# EAGLE schematic basic_sachematic (EAGLE 9.4.2)
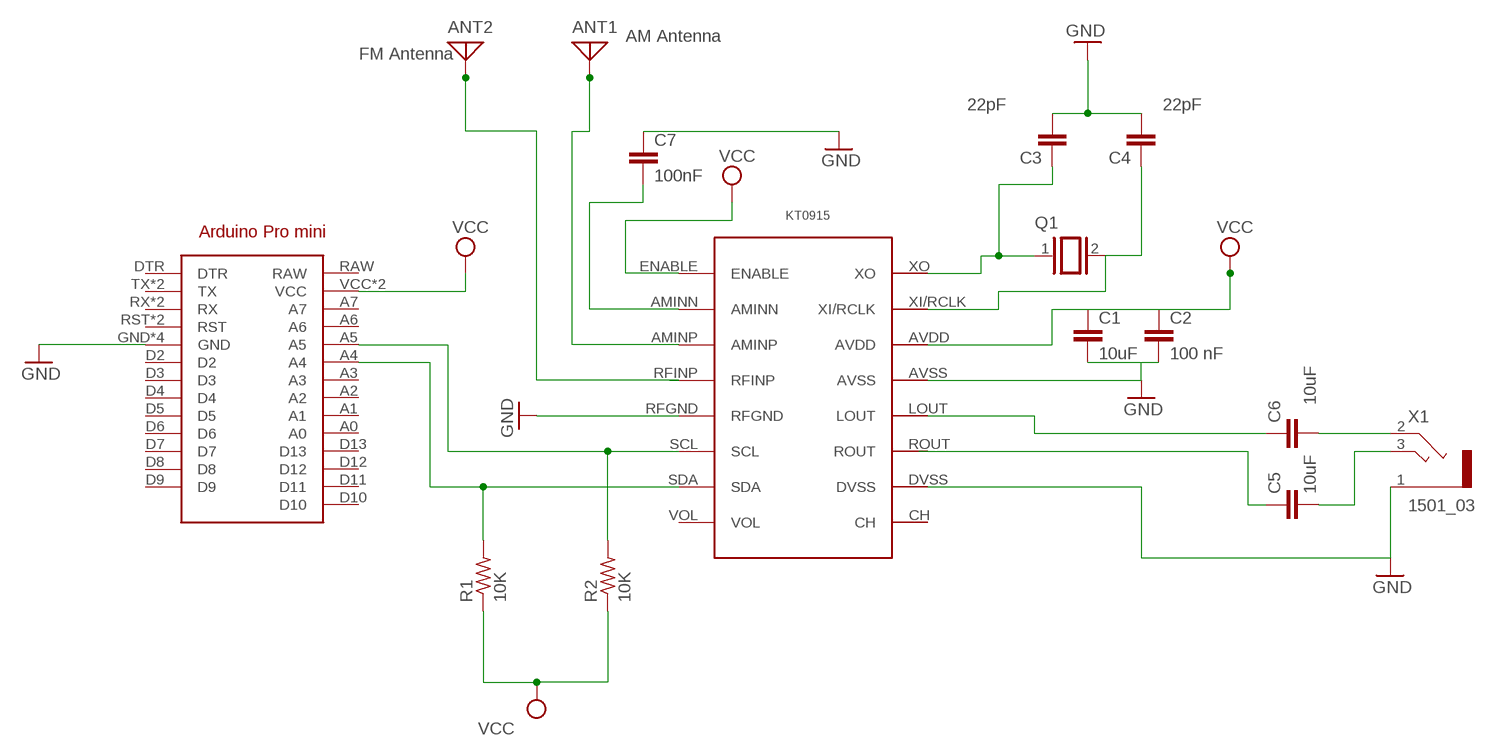
[diagram p0: schematic, sheet 1]

## Parts
ANT1  AM Antenna  ANTENNA  [PAD-01]
ANT2  FM Antenna  ANTENNA  [PAD-01]
ARDUINO1  ARDUINO_PRO_MINI  [ARDUINO_PRO_MINI]
C1  10uF  10UF-0603-6.3V-20%  [0603]
C2  100 nF  C-EUC1825K  [C1825K]
C3  22pF  C-EUC1825K  [C1825K]
C4  22pF  C-EUC1825K  [C1825K]
C5  10uF  C-EUC1825K  [C1825K]
C6  10uF  C-EUC1825K  [C1825K]
C7  100nF  C-EUC1825K  [C1825K]
KT0915  KT0915  [KT0915]
Q1  XTAL  [Q]
R1  10K  FLIPFLOP-RES  [0805-THM]
R2  10K  FLIPFLOP-RES  [0805-THM]
X1  1501_03  [1501_03]

## Nets
GND: ARDUINO1.GND ARDUINO1.GND@1(GND) ARDUINO1.GND@2(GND) ARDUINO1.GND@3(GND) C1.2 C2.2 C3.2 C4.2 C7.1 KT0915.AVSS KT0915.DVSS KT0915.RFGND X1.1
N$2: ARDUINO1.A4 KT0915.SDA R1.2
N$3: ARDUINO1.A5 KT0915.SCL R2.2
N$4: C4.1 KT0915.XI/RCLK Q1.2
N$5: C3.1 KT0915.XO Q1.1
N$6: C6.1 KT0915.LOUT
N$7: C6.2 X1.2
N$8: C5.2 X1.3
N$9: C7.2 KT0915.AMINN
N$11: ANT1.1 KT0915.AMINP
N$12: ANT2.1 KT0915.RFINP
N$26: C5.1 KT0915.ROUT
VCC: ARDUINO1.VCC ARDUINO1.VCC@1(VCC) C1.1 C2.1 KT0915.AVDD KT0915.ENABLE R1.1 R2.1
Unconnected: ARDUINO1.A0 ARDUINO1.A1 ARDUINO1.A2 ARDUINO1.A3 ARDUINO1.A6 ARDUINO1.A7 ARDUINO1.D2 ARDUINO1.D3 ARDUINO1.D4 ARDUINO1.D5 ARDUINO1.D6 ARDUINO1.D7 ARDUINO1.D8 ARDUINO1.D9 ARDUINO1.D10 ARDUINO1.D11 ARDUINO1.D12 ARDUINO1.D13 ARDUINO1.DTR ARDUINO1.RAW ARDUINO1.RST ARDUINO1.RST@1(RST) ARDUINO1.RX ARDUINO1.RX@1(RX) ARDUINO1.TX ARDUINO1.TX@1(TX) KT0915.CH KT0915.VOL

## Library data of the parts
ANT1 ANT2 = discrete:ANTENNA: Antenna
ARDUINO1 = arduinopromini:ARDUINO_PRO_MINI: For creating Arduino Pro Mini shields
C1 = SparkFun-Capacitors:10UF: 10.0µF ceramic capacitors A capacitor is a passive two-terminal electrical component used to store electrical energy temporarily in an electric field.; PROD_ID: CAP-11015
C2-C7 = rcl:C-EU: CAPACITOR, European symbol; SPICEPREFIX: C
KT0915 = dp_devices:KT0915
Q1 = special:XTAL: CRYSTAL
R1 R2 = adafruit:FLIPFLOP-RES: Flip Flop resistor An 0805 resistor inside a standard 1/4W 5% resistor. Makes for easy mods
X1 = con-lumberg:1501_03: Klinkensteckverbinder nach JISC 6560, 2,5 mm Jack connectors according to JISC 6560, 2.5 mm Source: http://www.lumberg.com/Produkte/PDFs/1501_03.pdf; OC_FARNELL: 1200127; OC_NEWARK: unknown